# Altium schematic sheet UART_control.SchDoc
size A4
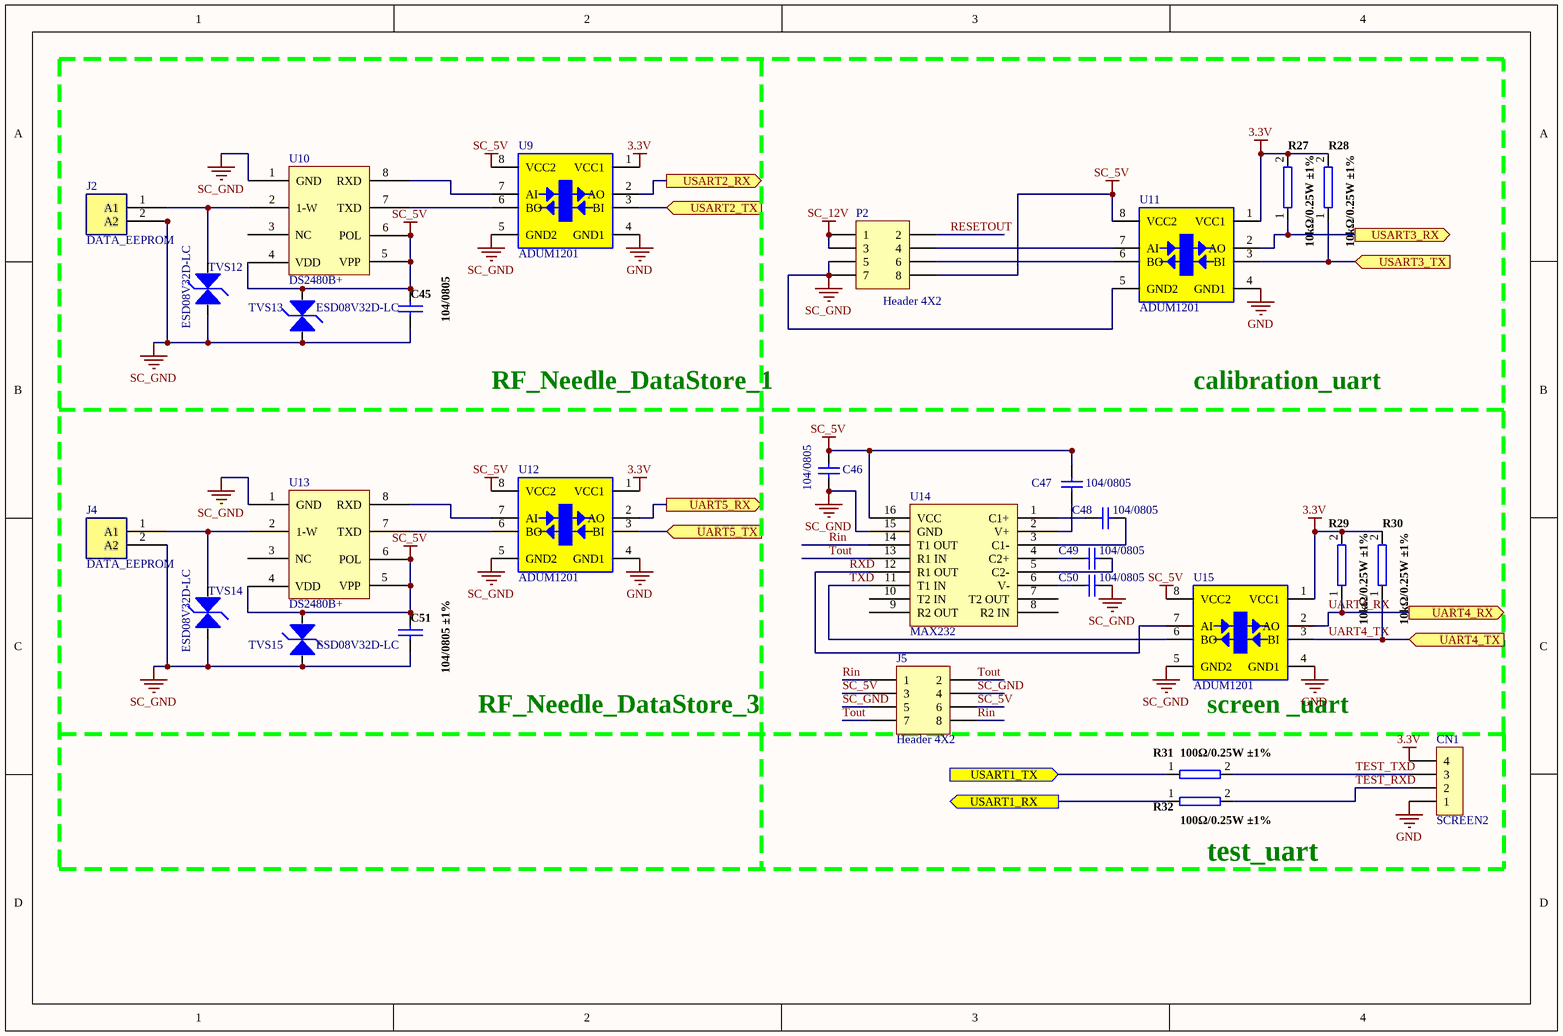
[diagram p0: UART_control.SchDoc]

## Parts
C45  104/0805  [C0805]
C46  104/0805  [C0805]
C47  104/0805  [C0805]
C48  104/0805  [C0805]
C49  104/0805  [C0805]
C50  104/0805  [C0805]
C51  104/0805 ±1%  [C0805]
CN1  SCREEN2  [4Pin-2.54]
J2  DATA_EEPROM  [XH2]
J4  DATA_EEPROM  [XH2]
J5  Header 4X2  [IDC4*2]
P2  Header 4X2  [RJ45]
R27  10kΩ/0.25W ±1%  [R0805]
R28  10kΩ/0.25W ±1%  [R0805]
R29  10kΩ/0.25W ±1%  [R0805]
R30  10kΩ/0.25W ±1%  [R0805]
R31  100Ω/0.25W ±1%  [R0805]
R32  100Ω/0.25W ±1%  [R0805]
TVS12  ESD08V32D-LC  [SOD323]
TVS13  ESD08V32D-LC  [SOD323]
TVS14  ESD08V32D-LC  [SOD323]
TVS15  ESD08V32D-LC  [SOD323]
U9  ADUM1201  [SOIC8_N]
U10  DS2480B+  [SOIC8_N]
U11  ADUM1201  [SOIC8_N]
U12  ADUM1201  [SOIC8_N]
U13  DS2480B+  [SOIC8_N]
U14  MAX232  [SOP16]
U15  ADUM1201  [SOIC8_N]

## Ports
UART4_RX (out), UART4_TX (in), UART5_RX (out), UART5_TX (in), USART1_RX (out), USART1_TX (in), USART2_RX (out), USART2_TX (in), USART3_RX (out), USART3_TX (in)

## Nets
3.3V: CN1.4 R27.2 R28.2 R29.2 R30.2 U9.1(VCC1) U11.1(VCC1) U12.1(VCC1) U15.1(VCC1)
GND: CN1.1 U9.4(GND1) U11.4(GND1) U12.4(GND1) U15.4(GND1)
SC_5V: C45.2 C46.2 C47.1 C51.2 J5.3 J5.6 P2.8 TVS13.1 TVS15.1 U9.8(VCC2) U10.4(VDD) U10.5(VPP) U10.6(POL) U11.8(VCC2) U12.8(VCC2) U13.4(VDD) U13.5(VPP) U13.6(POL) U14.16(VCC) U15.8(VCC2)
SC_12V: P2.1 P2.3
SC_GND: C45.1 C46.1 C50.2 C51.1 J2.2(A2) J4.2(A2) J5.4 J5.5 P2.5 P2.7 TVS12.2 TVS13.2 TVS14.2 TVS15.2 U9.5(GND2) U10.1(GND) U11.5(GND2) U12.5(GND2) U13.1(GND) U14.15(GND) U15.5(GND2)
RESETOUT: P2.2
Rin: J5.1 J5.8 U14.14(T1_OUT)
RXD: U14.12(R1_OUT) U15.7(AI)
TEST_RXD: CN1.2 R32.2
TEST_TXD: CN1.3 R31.2
Tout: J5.2 J5.7 U14.13(R1_IN)
TXD: U14.11(T1_IN) U15.6(BO)
UART4_RX: R29.1 U15.2(AO) ; port UART4_RX
UART4_TX: R30.1 U15.3(BI) ; port UART4_TX
UART5_RX: U12.2(AO) ; port UART5_RX
UART5_TX: U12.3(BI) ; port UART5_TX
USART1_RX: R32.1 ; port USART1_RX
USART1_TX: R31.1 ; port USART1_TX
USART2_RX: U9.2(AO) ; port USART2_RX
USART2_TX: U9.3(BI) ; port USART2_TX
USART3_RX: R27.1 U11.2(AO) ; port USART3_RX
USART3_TX: R28.1 U11.3(BI) ; port USART3_TX
NetC47_2: C47.2 U14.2(V+)
NetC48_1: C48.1 U14.1(C1+)
NetC48_2: C48.2 U14.3(C1-)
NetC49_1: C49.1 U14.4(C2+)
NetC49_2: C49.2 U14.5(C2-)
NetC50_1: C50.1 U14.6(V-)
NetJ2_1: J2.1(A1) TVS12.1 U10.2(1-W)
NetJ4_1: J4.1(A1) TVS14.1 U13.2(1-W)
NetP2_4: P2.4 U11.7(AI)
NetP2_6: P2.6 U11.6(BO)
NetU9_6: U9.6(BO) U10.7(TXD)
NetU9_7: U9.7(AI) U10.8(RXD)
NetU12_6: U12.6(BO) U13.7(TXD)
NetU12_7: U12.7(AI) U13.8(RXD)

Not connected (* = marked no-connect by the designer): U10 3(NC); U13 3(NC); U14 7(T2_OUT) 8(R2_IN) 9(R2_OUT) 10(T2_IN)

## Notes on the sheet
- RF_Needle_DataStore_1
- calibration_uart
- RF_Needle_DataStore_3
- (near U15) screen _uart
- (near R32) test_uart

## Library data of the parts
C45 C51 = CAP: 贴片电容 104/25V ±1% C0805; 物: *; 部: *; 供: *
C46 = Cap: 贴片电容 104/25V ±1% C0805; Published: 8-Jun-2000; LatestRevisionDate: 17-Jul-2002; LatestRevisionNote: Re-released for DXP Platform.; PackageReference: RAD-0.3; Publisher: Altium Limited
C47-C50 = Cap: 贴片电容 104/25V ±1% C0805; Value: 104; Published: 8-Jun-2000; LatestRevisionDate: 17-Jul-2002; LatestRevisionNote: Re-released for DXP Platform.; PackageReference: RAD-0.3; Publisher: Altium Limited
CN1 = CON4: 单排排针（4针） 2.54mm 4Pin-2.54
J2 J4 = CON2: 插座式端子 XH2.54-2P 250V(DC/AC) 3A
J5 = Header 4X2: 双排排针（4针） 2.54mm IDC4*2; LatestRevisionDate: 17-Jul-2002; LatestRevisionNote: Re-released for DXP Platform.; Publisher: Altium Limited
P2 = Header 4X2: RJ45插座 RJ45; LatestRevisionDate: 17-Jul-2002; LatestRevisionNote: Re-released for DXP Platform.; Publisher: Altium Limited
R27-R30 = RES2: 贴片电阻 10kΩ 0.25W ±1% R0805
R31 R32 = RES2: 贴片电阻 100Ω 0.25W ±1% R0805
TVS12-TVS15 = TVS: ESD静电二极管 ESD08V32D-LC 5V 15KV 40A SOD323
U9 U11 U12 U15 = ADUM1201: 双通道数字隔离器 ADUM1201 SOIC8_N
U10 U13 = DS2480B+: 1-Wire线驱动器 DS2480B SOIC8_N
U14 = MAX232_DIP16: 串口通信转换芯片 MAX232 SOP16